# Altium schematic sheet Chips.SchDoc
size A4; SheetNumber: 2; SheetTotal: 7
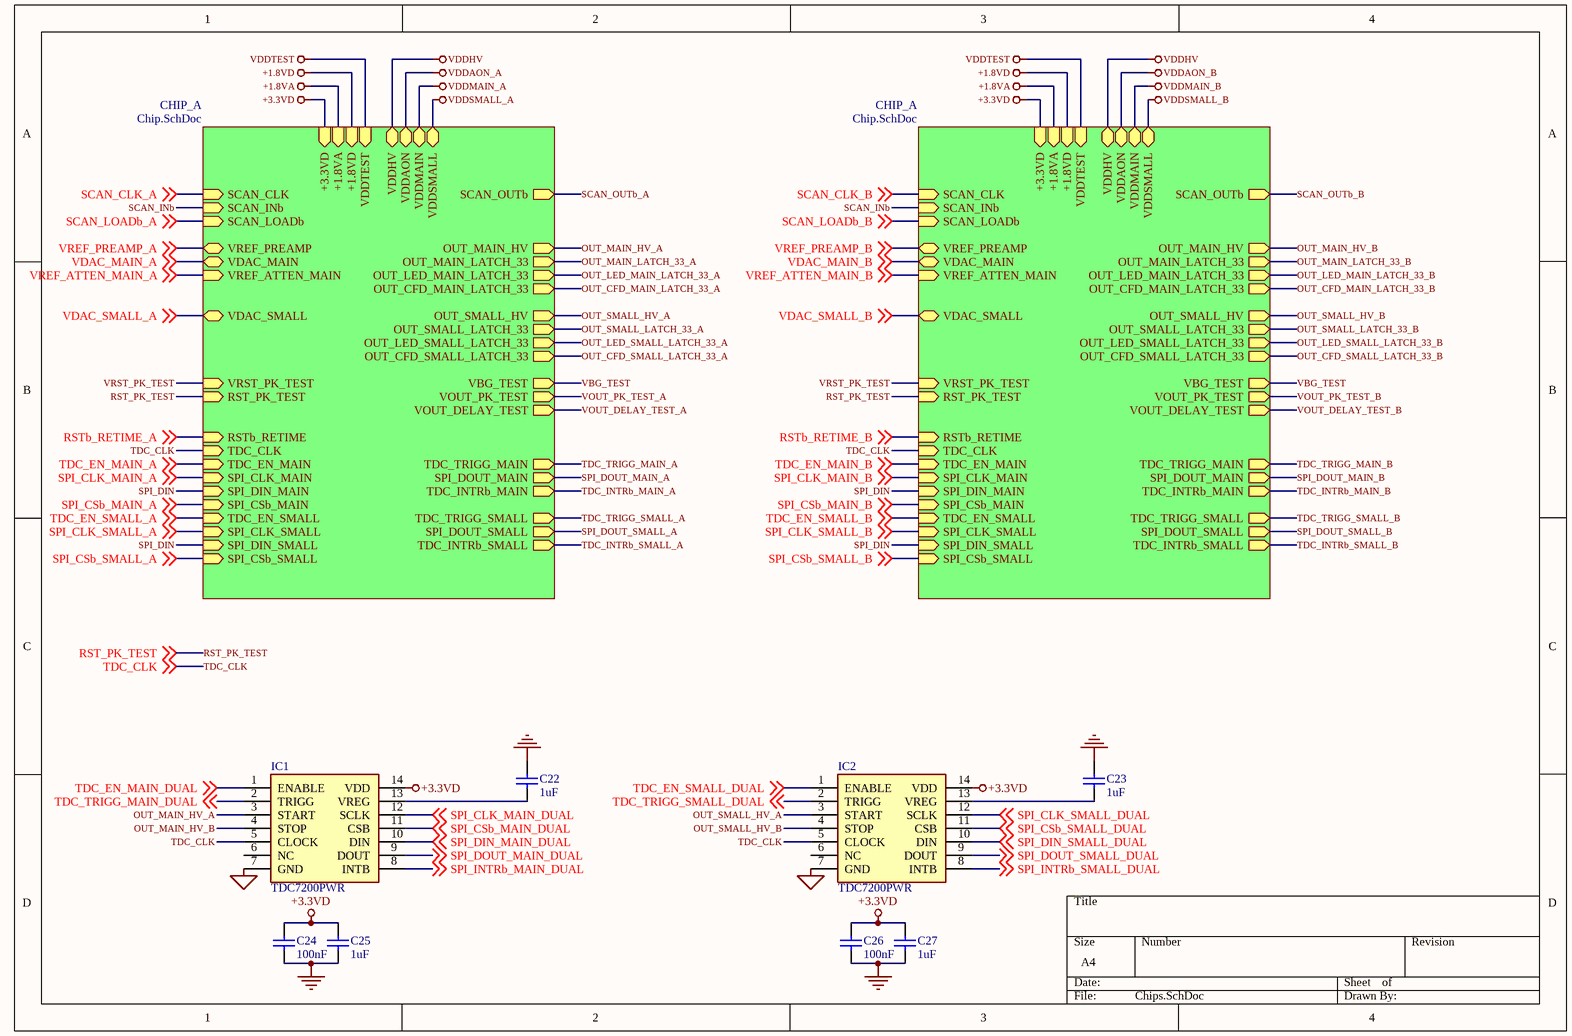
[diagram p0: Chips.SchDoc]

## Parts
C22  1uF  [CAPC1608X90X35ML10T15]
C23  1uF  [CAPC1608X90X35ML10T15]
C24  100nF  [CAPC1608X90X35ML10T15]
C25  1uF  [CAPC1608X90X35ML10T15]
C26  100nF  [CAPC1608X90X35ML10T15]
C27  1uF  [CAPC1608X90X35ML10T15]
IC1  TDC7200PWR  [SOP65P640X120-14N]
IC2  TDC7200PWR  [SOP65P640X120-14N]

## Sub-sheets
CHIP_A = Chip.SchDoc: VREF_ATTEN_MAIN (in), VDDAON (bidir), VDDHV (bidir), OUT_MAIN_HV (out), SCAN_INb (in), SCAN_LOADb (in), VBG_TEST (out), VOUT_PK_TEST (out), SCAN_CLK (in), VRST_PK_TEST (in), VOUT_DELAY_TEST (out), VDDTEST (in), VDAC_MAIN (bidir), VREF_PREAMP (bidir), VDAC_SMALL (bidir), RST_PK_TEST (in), VDDMAIN (bidir), SCAN_OUTb (out), VDDSMALL (bidir), OUT_SMALL_HV (out), RSTb_RETIME (in), +1.8VD (in), +3.3VD (in), +1.8VA (in), OUT_LED_MAIN_LATCH_33 (out), OUT_CFD_MAIN_LATCH_33 (out), OUT_LED_SMALL_LATCH_33 (out), OUT_CFD_SMALL_LATCH_33 (out), OUT_MAIN_LATCH_33 (out), OUT_SMALL_LATCH_33 (out), TDC_CLK (in), SPI_CLK_MAIN (in), SPI_DIN_MAIN (in), SPI_CSb_MAIN (in), TDC_INTRb_MAIN (out), SPI_DOUT_MAIN (out), TDC_EN_MAIN (in), TDC_TRIGG_MAIN (out), SPI_CLK_SMALL (in), SPI_DIN_SMALL (in), SPI_CSb_SMALL (in), TDC_INTRb_SMALL (out), SPI_DOUT_SMALL (out), TDC_EN_SMALL (in), TDC_TRIGG_SMALL (out)
CHIP_A = Chip.SchDoc: VREF_ATTEN_MAIN (in), VDDAON (bidir), VDDHV (bidir), OUT_MAIN_HV (out), SCAN_INb (in), SCAN_LOADb (in), VBG_TEST (out), VOUT_PK_TEST (out), SCAN_CLK (in), VRST_PK_TEST (in), VOUT_DELAY_TEST (out), VDDTEST (in), VDAC_MAIN (bidir), VREF_PREAMP (bidir), VDAC_SMALL (bidir), RST_PK_TEST (in), VDDMAIN (bidir), SCAN_OUTb (out), VDDSMALL (bidir), OUT_SMALL_HV (out), RSTb_RETIME (in), +1.8VD (in), +3.3VD (in), +1.8VA (in), OUT_LED_MAIN_LATCH_33 (out), OUT_CFD_MAIN_LATCH_33 (out), OUT_LED_SMALL_LATCH_33 (out), OUT_CFD_SMALL_LATCH_33 (out), OUT_MAIN_LATCH_33 (out), OUT_SMALL_LATCH_33 (out), TDC_CLK (in), SPI_CLK_MAIN (in), SPI_DIN_MAIN (in), SPI_CSb_MAIN (in), TDC_INTRb_MAIN (out), SPI_DOUT_MAIN (out), TDC_EN_MAIN (in), TDC_TRIGG_MAIN (out), SPI_CLK_SMALL (in), SPI_DIN_SMALL (in), SPI_CSb_SMALL (in), TDC_INTRb_SMALL (out), SPI_DOUT_SMALL (out), TDC_EN_SMALL (in), TDC_TRIGG_SMALL (out)

## Nets
+1.8VA: sheet CHIP_A/+1.8VA, sheet CHIP_A/+1.8VA
+1.8VD: sheet CHIP_A/+1.8VD, sheet CHIP_A/+1.8VD
+3.3VD: C24.1 C25.1 C26.1 C27.1 IC1.14(VDD) IC2.14(VDD) ; sheet CHIP_A/+3.3VD, sheet CHIP_A/+3.3VD
GND: C22.2 C23.2 C24.2 C25.2 C26.2 C27.2 IC1.7(GND) IC2.7(GND)
VDDAON_A: sheet CHIP_A/VDDAON
VDDAON_B: sheet CHIP_A/VDDAON
VDDHV: sheet CHIP_A/VDDHV, sheet CHIP_A/VDDHV
VDDMAIN_A: sheet CHIP_A/VDDMAIN
VDDMAIN_B: sheet CHIP_A/VDDMAIN
VDDSMALL_A: sheet CHIP_A/VDDSMALL
VDDSMALL_B: sheet CHIP_A/VDDSMALL
VDDTEST: sheet CHIP_A/VDDTEST, sheet CHIP_A/VDDTEST
OUT_CFD_MAIN_LATCH_33_A: sheet CHIP_A/OUT_CFD_MAIN_LATCH_33
OUT_CFD_MAIN_LATCH_33_B: sheet CHIP_A/OUT_CFD_MAIN_LATCH_33
OUT_CFD_SMALL_LATCH_33_A: sheet CHIP_A/OUT_CFD_SMALL_LATCH_33
OUT_CFD_SMALL_LATCH_33_B: sheet CHIP_A/OUT_CFD_SMALL_LATCH_33
OUT_LED_MAIN_LATCH_33_A: sheet CHIP_A/OUT_LED_MAIN_LATCH_33
OUT_LED_MAIN_LATCH_33_B: sheet CHIP_A/OUT_LED_MAIN_LATCH_33
OUT_LED_SMALL_LATCH_33_A: sheet CHIP_A/OUT_LED_SMALL_LATCH_33
OUT_LED_SMALL_LATCH_33_B: sheet CHIP_A/OUT_LED_SMALL_LATCH_33
OUT_MAIN_HV_A: IC1.3(START) ; sheet CHIP_A/OUT_MAIN_HV
OUT_MAIN_HV_B: IC1.4(STOP) ; sheet CHIP_A/OUT_MAIN_HV
OUT_MAIN_LATCH_33_A: sheet CHIP_A/OUT_MAIN_LATCH_33
OUT_MAIN_LATCH_33_B: sheet CHIP_A/OUT_MAIN_LATCH_33
OUT_SMALL_HV_A: IC2.3(START) ; sheet CHIP_A/OUT_SMALL_HV
OUT_SMALL_HV_B: IC2.4(STOP) ; sheet CHIP_A/OUT_SMALL_HV
OUT_SMALL_LATCH_33_A: sheet CHIP_A/OUT_SMALL_LATCH_33
OUT_SMALL_LATCH_33_B: sheet CHIP_A/OUT_SMALL_LATCH_33
RST_PK_TEST: off-sheet RST_PK_TEST, sheet CHIP_A/RST_PK_TEST, sheet CHIP_A/RST_PK_TEST
RSTb_RETIME_A: off-sheet RSTb_RETIME_A, sheet CHIP_A/RSTb_RETIME
RSTb_RETIME_B: off-sheet RSTb_RETIME_B, sheet CHIP_A/RSTb_RETIME
SCAN_CLK_A: off-sheet SCAN_CLK_A, sheet CHIP_A/SCAN_CLK
SCAN_CLK_B: off-sheet SCAN_CLK_B, sheet CHIP_A/SCAN_CLK
SCAN_INb: sheet CHIP_A/SCAN_INb, sheet CHIP_A/SCAN_INb
SCAN_LOADb_A: off-sheet SCAN_LOADb_A, sheet CHIP_A/SCAN_LOADb
SCAN_LOADb_B: off-sheet SCAN_LOADb_B, sheet CHIP_A/SCAN_LOADb
SCAN_OUTb_A: sheet CHIP_A/SCAN_OUTb
SCAN_OUTb_B: sheet CHIP_A/SCAN_OUTb
SPI_CLK_MAIN_A: off-sheet SPI_CLK_MAIN_A, sheet CHIP_A/SPI_CLK_MAIN
SPI_CLK_MAIN_B: off-sheet SPI_CLK_MAIN_B, sheet CHIP_A/SPI_CLK_MAIN
SPI_CLK_MAIN_DUAL: IC1.12(SCLK) ; off-sheet SPI_CLK_MAIN_DUAL
SPI_CLK_SMALL_A: off-sheet SPI_CLK_SMALL_A, sheet CHIP_A/SPI_CLK_SMALL
SPI_CLK_SMALL_B: off-sheet SPI_CLK_SMALL_B, sheet CHIP_A/SPI_CLK_SMALL
SPI_CLK_SMALL_DUAL: IC2.12(SCLK) ; off-sheet SPI_CLK_SMALL_DUAL
SPI_CSb_MAIN_A: off-sheet SPI_CSb_MAIN_A, sheet CHIP_A/SPI_CSb_MAIN
SPI_CSb_MAIN_B: off-sheet SPI_CSb_MAIN_B, sheet CHIP_A/SPI_CSb_MAIN
SPI_CSb_MAIN_DUAL: IC1.11(CSB) ; off-sheet SPI_CSb_MAIN_DUAL
SPI_CSb_SMALL_A: off-sheet SPI_CSb_SMALL_A, sheet CHIP_A/SPI_CSb_SMALL
SPI_CSb_SMALL_B: off-sheet SPI_CSb_SMALL_B, sheet CHIP_A/SPI_CSb_SMALL
SPI_CSb_SMALL_DUAL: IC2.11(CSB) ; off-sheet SPI_CSb_SMALL_DUAL
SPI_DIN: sheet CHIP_A/SPI_DIN_MAIN, sheet CHIP_A/SPI_DIN_SMALL, sheet CHIP_A/SPI_DIN_MAIN, sheet CHIP_A/SPI_DIN_SMALL
SPI_DIN_MAIN_DUAL: IC1.10(DIN) ; off-sheet SPI_DIN_MAIN_DUAL
SPI_DIN_SMALL_DUAL: IC2.10(DIN) ; off-sheet SPI_DIN_SMALL_DUAL
SPI_DOUT_MAIN_A: sheet CHIP_A/SPI_DOUT_MAIN
SPI_DOUT_MAIN_B: sheet CHIP_A/SPI_DOUT_MAIN
SPI_DOUT_MAIN_DUAL: IC1.9(DOUT) ; off-sheet SPI_DOUT_MAIN_DUAL
SPI_DOUT_SMALL_A: sheet CHIP_A/SPI_DOUT_SMALL
SPI_DOUT_SMALL_B: sheet CHIP_A/SPI_DOUT_SMALL
SPI_DOUT_SMALL_DUAL: IC2.9(DOUT) ; off-sheet SPI_DOUT_SMALL_DUAL
SPI_INTRb_MAIN_DUAL: IC1.8(INTB) ; off-sheet SPI_INTRb_MAIN_DUAL
SPI_INTRb_SMALL_DUAL: IC2.8(INTB) ; off-sheet SPI_INTRb_SMALL_DUAL
TDC_CLK: IC1.5(CLOCK) IC2.5(CLOCK) ; off-sheet TDC_CLK, sheet CHIP_A/TDC_CLK, sheet CHIP_A/TDC_CLK
TDC_EN_MAIN_A: off-sheet TDC_EN_MAIN_A, sheet CHIP_A/TDC_EN_MAIN
TDC_EN_MAIN_B: off-sheet TDC_EN_MAIN_B, sheet CHIP_A/TDC_EN_MAIN
TDC_EN_MAIN_DUAL: IC1.1(ENABLE) ; off-sheet TDC_EN_MAIN_DUAL
TDC_EN_SMALL_A: off-sheet TDC_EN_SMALL_A, sheet CHIP_A/TDC_EN_SMALL
TDC_EN_SMALL_B: off-sheet TDC_EN_SMALL_B, sheet CHIP_A/TDC_EN_SMALL
TDC_EN_SMALL_DUAL: IC2.1(ENABLE) ; off-sheet TDC_EN_SMALL_DUAL
TDC_INTRb_MAIN_A: sheet CHIP_A/TDC_INTRb_MAIN
TDC_INTRb_MAIN_B: sheet CHIP_A/TDC_INTRb_MAIN
TDC_INTRb_SMALL_A: sheet CHIP_A/TDC_INTRb_SMALL
TDC_INTRb_SMALL_B: sheet CHIP_A/TDC_INTRb_SMALL
TDC_TRIGG_MAIN_A: sheet CHIP_A/TDC_TRIGG_MAIN
TDC_TRIGG_MAIN_B: sheet CHIP_A/TDC_TRIGG_MAIN
TDC_TRIGG_MAIN_DUAL: IC1.2(TRIGG) ; off-sheet TDC_TRIGG_MAIN_DUAL
TDC_TRIGG_SMALL_A: sheet CHIP_A/TDC_TRIGG_SMALL
TDC_TRIGG_SMALL_B: sheet CHIP_A/TDC_TRIGG_SMALL
TDC_TRIGG_SMALL_DUAL: IC2.2(TRIGG) ; off-sheet TDC_TRIGG_SMALL_DUAL
VBG_TEST: sheet CHIP_A/VBG_TEST, sheet CHIP_A/VBG_TEST
VDAC_MAIN_A: off-sheet VDAC_MAIN_A, sheet CHIP_A/VDAC_MAIN
VDAC_MAIN_B: off-sheet VDAC_MAIN_B, sheet CHIP_A/VDAC_MAIN
VDAC_SMALL_A: off-sheet VDAC_SMALL_A, sheet CHIP_A/VDAC_SMALL
VDAC_SMALL_B: off-sheet VDAC_SMALL_B, sheet CHIP_A/VDAC_SMALL
VOUT_DELAY_TEST_A: sheet CHIP_A/VOUT_DELAY_TEST
VOUT_DELAY_TEST_B: sheet CHIP_A/VOUT_DELAY_TEST
VOUT_PK_TEST_A: sheet CHIP_A/VOUT_PK_TEST
VOUT_PK_TEST_B: sheet CHIP_A/VOUT_PK_TEST
VREF_ATTEN_MAIN_A: off-sheet VREF_ATTEN_MAIN_A, sheet CHIP_A/VREF_ATTEN_MAIN
VREF_ATTEN_MAIN_B: off-sheet VREF_ATTEN_MAIN_B, sheet CHIP_A/VREF_ATTEN_MAIN
VREF_PREAMP_A: off-sheet VREF_PREAMP_A, sheet CHIP_A/VREF_PREAMP
VREF_PREAMP_B: off-sheet VREF_PREAMP_B, sheet CHIP_A/VREF_PREAMP
VRST_PK_TEST: sheet CHIP_A/VRST_PK_TEST, sheet CHIP_A/VRST_PK_TEST
NetC22_1: C22.1 IC1.13(VREG)
NetC23_1: C23.1 IC2.13(VREG)

Not connected (* = marked no-connect by the designer): IC1 6(NC); IC2 6(NC)

## Library data of the parts
C22-C27 = CMP-2000-04945-1: 0603; Manufacturer: Murata; Capacitance: 22pF; Tolerance (%): ±5%; Rated Voltage: 50V; Dielectric: C0G; Manufacturer URL: http://www.murata.com/; Datasheet Version: Jul-06; Package Reference: 603; Case Size/Dimension: 0603; Package Description: 2-Pin Surface Mount Device, Body 1.6 x 0.8 mm; Datasheet URL: https://datasheet.ciiva.com/11786/0900766b807a1cab-11786398.pdf
IC1 IC2 = TDC7200PWR: Integrated Circuit; Manufacturer_Name: Texas Instruments; Datasheet Link: http://www.ti.com/lit/gpn/tdc7200; Height: 1.2mm; Manufacturer_Part_Number: TDC7200PWR